# Altium schematic sheet 1_P1.schdoc
size 307 x 218 mm; Symbol: Drawing-Symbol_A4; Device: Drawing-Symbol_A4; @Project Name: pico-led; @Page Count: 1; @Update Date: 2025-05-20; @Create Date: 2025-03-28; @Schematic Name: Schematic1; @Page No: 1; @Page Name: P1; Company: EasyEDA.com; Version: V1.0; Page Size: A4; @Create Time: 21:47:33; @Update Time: 01:55:11; Width: 1170; Height: 825; Region Start: 1; X Region Count: 6; Y Region Count: 4; Blade Width: 10; Title Block Position: 3; @Board Name: Board1
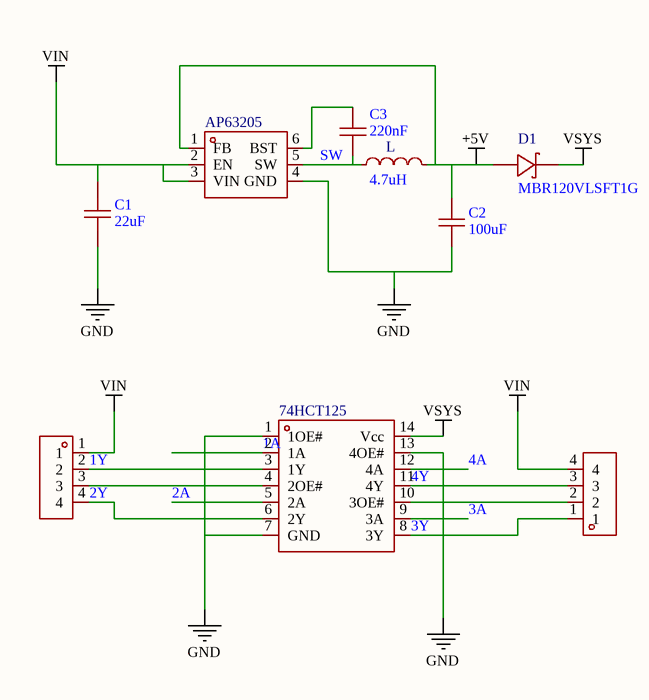
[diagram p0: 1_P1.schdoc]

## Parts
74HCT125  74HCT125T14-13  [TSSOP-14_L5.0-W4.4-P0.65-LS6.4-BL]  (value not drawn)
AP63205  AP63205WU-7  [TSOT-23-6_L2.9-W1.6-P0.95-LS2.8-BL]  (value not drawn)
C1  22uF  [C1210]
C2  100uF  [C1210]
C3  220nF  [C0603]
CN1  DB125-3.5-4P-GN-S  [CONN-TH_DB125-3.5-4P-GN]  (value not drawn)
CN2  DB125-3.5-4P-GN-S  [CONN-TH_DB125-3.5-4P-GN]  (value not drawn)
D1  MBR120VLSFT1G  [SOD-123F_L2.8-W1.8-LS3.7-RD]
L  4.7uH  [IND-SMD_L4.0-W4.0]

## Nets
+5V: AP63205.1(FB) C2.2 D1.2(A) L.2
GND: 74HCT125.1(1OE#) 74HCT125.4(2OE#) 74HCT125.7(GND) 74HCT125.10(3OE#) 74HCT125.13(4OE#) AP63205.4(GND) C1.1 C2.1 CN1.3 CN2.2
VIN: AP63205.2(EN) AP63205.3(VIN) C1.2 CN1.1 CN2.4
VSYS: 74HCT125.14(Vcc) D1.1(K)
1A: 74HCT125.2(1A)
1Y: 74HCT125.3(1Y) CN1.2
2A: 74HCT125.5(2A)
2Y: 74HCT125.6(2Y) CN1.4
3A: 74HCT125.9(3A)
3Y: 74HCT125.8(3Y) CN2.1
4A: 74HCT125.12(4A)
4Y: 74HCT125.11(4Y) CN2.3
SW: AP63205.5(SW) C3.1 L.1
NetAP63205_6: AP63205.6(BST) C3.2

## Notes on the sheet
- 1
- 2
- 3
- 4
- 5
- 6
- A
- B
- C
- Schematic
- Schematic1
- Create at
- Update at
- 2025-03-28
- 2025-05-20
- Board
- Drawn
- Board1
- Page
- P1
- D
- Reviewed
- Version
- Size
- pico-led
- Page  1  Total  1
- V1.0
- A4
- EasyEDA.com

## Library data of the parts
74HCT125 = 74HCT125T14-13: Manufacturer: DIODES(美台); Add into BOM: yes; output type: Tri-State; Supply Voltage: 4.5V~5.5V; Number of Elements: 4; Number of Bits per Element: 1; Sink Current: 4mA; Logic Family: 74HCT; Symbol: 74HCT125T14-13; Device: 74HCT125T14-13; LCSC Part Name: 74HCT125T14-13; Supplier Part: C842453; Manufacturer Part: 74HCT125T14-13; Supplier Footprint: TSSOP-14; JLCPCB Part Class: Extended Part; Datasheet: https://atta.szlcsc.com/upload/public/pdf/source/20210611/C842453_44966D70497D36F042B3AD5F171A07CB.pdf; Supplier: LCSC; Convert to PCB: yes; Source Current: 4mA; Operating Temperature: -40℃~+125℃
AP63205 = AP63205WU-7: Manufacturer: DIODES(美台); Add into BOM: yes; Function: Step-down type; Output Type: Fixed; Input Voltage: 3.8V~32V; Output Voltage: 5V; Output Current: 2A; Switching Frequency: 1100kHz; Number of Outputs: 1; Topology: Step-down; Quiescent Current (Iq): 22uA; Switch tube (built-in/external): Built-in; Symbol: AP63205WU-7; Device: AP63205WU-7; LCSC Part Name: 3.8V至32V输入、2A低静态电流同步降压转换器，增强EMI抑制; Supplier Part: C2071056; Manufacturer Part: AP63205WU-7; Supplier Footprint: TSOT-23-6; JLCPCB Part Class: Extended Part; Datasheet: https://atta.szlcsc.com/upload/public/pdf/source/20210622/C780769_099C67289BD3EC61AAFB52D8B07125B3.pdf; Supplier: LCSC; Convert to PCB: yes; Operating Temperature: -40℃~+85℃@(TA); Synchronous Rectification: Yes
C1 = GMK325BJ226MM-P: Manufacturer: TAIYO YUDEN(太诱); Add into BOM: yes; Tolerance: ±20%; Symbol: GMK325BJ226MM-P; Device: GMK325BJ226MM-P; LCSC Part Name: 22uF ±20% 35V; Supplier Part: C778721; Manufacturer Part: GMK325BJ226MM-P; Supplier Footprint: 1210; JLCPCB Part Class: Extended Part; Datasheet: https://atta.szlcsc.com/upload/public/pdf/source/20200107/C471398_4D150C2F82D9DF0CFE325EE548591887.pdf; Supplier: LCSC; Convert to PCB: yes; Value: 22uF
C2 = CL32A107MQVNNNE: Manufacturer: SAMSUNG(三星); Add into BOM: yes; Tolerance: ±20%; Symbol: CL32A107MQVNNNE; Device: CL32A107MQVNNNE; LCSC Part Name: 100uF ±20% 6.3V; Supplier Part: C49066; Manufacturer Part: CL32A107MQVNNNE; Supplier Footprint: 1210; JLCPCB Part Class: Extended Part; Datasheet: https://atta.szlcsc.com/upload/public/pdf/source/20160218/1457707763339.pdf; Supplier: LCSC; Convert to PCB: yes; Value: 100uF
C3 = CL10B224KB8NNNC: Manufacturer: SAMSUNG(三星); Add into BOM: yes; Tolerance: ±10%; Symbol: CL10B224KB8NNNC; Device: CL10B224KB8NNNC; LCSC Part Name: 220nF ±10% 50V; Supplier Part: C64705; Manufacturer Part: CL10B224KB8NNNC; Supplier Footprint: 0603; JLCPCB Part Class: Extended Part; Datasheet: https://atta.szlcsc.com/upload/public/pdf/source/20160218/1457707763339.pdf; Supplier: LCSC; Convert to PCB: yes; Value: 220nF
CN1 CN2 = DB125-3.5-4P-GN-S: Manufacturer: DORABO(地博电气); Add into BOM: yes; Structure: 1x4P; Pitch: 3.5mm; Current Rating (Max): 13.5A; Voltage Rating (Max): 250V; Wire Gauge - AWG: 16~28; Wire Gauge - mm2: 1; Number of PINs Per Row: 4; Symbol: DB125-3.5-4P-GN; Device: DB125-3.5-4P-GN-S; LCSC Part Name: 3.5mm 1x4P 排数:1 每排P数:4 直插; Supplier Part: C2757925; Manufacturer Part: DB125-3.5-4P-GN-S; Supplier Footprint: 插件,P=3.5mm; JLCPCB Part Class: Extended Part; Datasheet: https://atta.szlcsc.com/upload/public/pdf/source/20221227/3B943AA1CFCAE24F1BA4E72404938A89.pdf; Supplier: LCSC; Convert to PCB: yes; Color: Green; Mounting Style: Straight; Number of Pins: 4P; Number of Rows: 1; Operating Temperature Range: -40℃~+105℃
D1 = MBR120VLSFT1G: Manufacturer: onsemi(安森美); Add into BOM: yes; Forward Voltage (Vf@If): 300mV@1A; Reverse Voltage (Vr): 20V; Average Rectified Current (Io): 1A; Reverse Leakage Current (Ir): 600uA@20V; Symbol: MBR120VLSFT1G; Device: MBR120VLSFT1G; LCSC Part Name: 电压:20V 电流:1A; Supplier Part: C223608; Manufacturer Part: MBR120VLSFT1G; Supplier Footprint: SOD-123FL; JLCPCB Part Class: Extended Part; Datasheet: https://atta.szlcsc.com/upload/public/pdf/source/20221020/29D26ECD33A75D76A8E47ED9553F3BCF.pdf; Supplier: LCSC; Convert to PCB: yes
L = CR4030-4R7M: Manufacturer: ceaiya(柯爱亚); Add into BOM: yes; Tolerance: ±20%; Saturation Current (Isat): 2.9A; Symbol: CR4030-4R7M; Device: CR4030-4R7M; LCSC Part Name: 4.7uH ±20% 2.9A; Supplier Part: C520319; Manufacturer Part: CR4030-4R7M; Supplier Footprint: SMD,4x4mm; JLCPCB Part Class: Extended Part; Datasheet: https://atta.szlcsc.com/upload/public/pdf/source/20200424/C520276_8639ABF18B4A41322D74F24464FD005B.pdf; Supplier: LCSC; Convert to PCB: yes; Value: 4.7uH